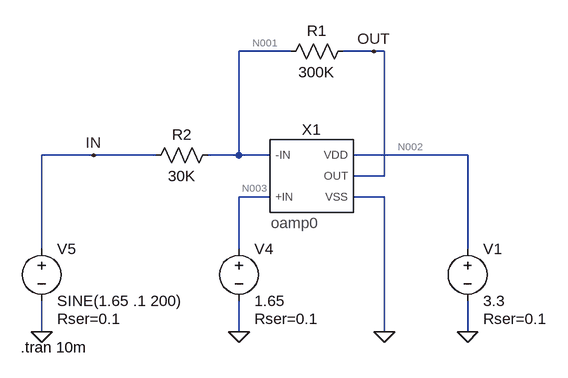
[diagram p0: schematic oamp0_test.asc]
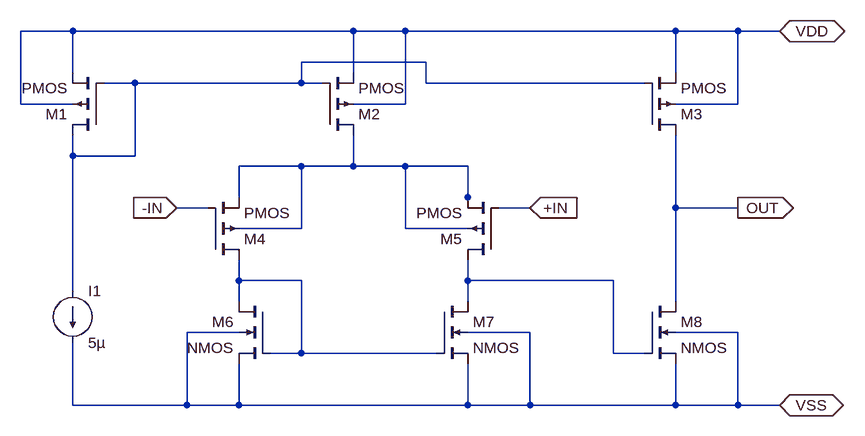
[diagram p1: sub-circuit oamp0.asc]
oamp0_test.asc, the LTspice schematic file:
Version 4
SHEET 1 1004 680
WIRE -160 -96 -240 -96
WIRE -32 -96 -80 -96
WIRE -16 -96 -32 -96
WIRE -464 64 -544 64
WIRE -368 64 -464 64
WIRE -240 64 -240 -96
WIRE -240 64 -288 64
WIRE -192 64 -240 64
WIRE 112 64 -64 64
WIRE -16 96 -16 -96
WIRE -16 96 -64 96
WIRE -192 128 -240 128
WIRE -16 128 -64 128
WIRE -544 208 -544 64
WIRE -240 208 -240 128
WIRE 112 208 112 64
WIRE -544 336 -544 288
WIRE -240 336 -240 288
WIRE -16 336 -16 128
WIRE 112 336 112 288
FLAG 112 336 0
FLAG -16 336 0
FLAG -240 336 0
FLAG -544 336 0
FLAG -464 64 IN
FLAG -32 -96 OUT
SYMBOL res -64 -112 R90
WINDOW 0 0 56 VBottom 2
WINDOW 3 32 56 VTop 2
SYMATTR InstName R1
SYMATTR Value 300K
SYMBOL res -272 48 R90
WINDOW 0 0 56 VBottom 2
WINDOW 3 32 56 VTop 2
SYMATTR InstName R2
SYMATTR Value 30K
SYMBOL oamp0 -128 96 R0
SYMATTR InstName X1
SYMBOL voltage 112 192 R0
WINDOW 123 0 0 Left 2
WINDOW 39 24 124 Left 2
SYMATTR SpiceLine Rser=0.1
SYMATTR InstName V1
SYMATTR Value 3.3
SYMBOL voltage -240 192 R0
WINDOW 123 0 0 Left 2
WINDOW 39 24 124 Left 2
SYMATTR SpiceLine Rser=0.1
SYMATTR InstName V4
SYMATTR Value 1.65
SYMBOL voltage -544 192 R0
WINDOW 123 0 0 Left 2
WINDOW 39 24 124 Left 2
SYMATTR SpiceLine Rser=0.1
SYMATTR InstName V5
SYMATTR Value SINE(1.65 .1 200)
TEXT -576 360 Left 2 !.tran 10m

oamp0.asc, the sub-circuit schematic file:
Version 4
SHEET 1 1132 680
WIRE -64 -16 -144 -16
WIRE 368 -16 -64 -16
WIRE 448 -16 368 -16
WIRE 864 -16 448 -16
WIRE 960 -16 864 -16
WIRE 1024 -16 960 -16
WIRE 480 32 288 32
WIRE -64 48 -64 -16
WIRE 368 48 368 -16
WIRE 864 48 864 -16
WIRE 32 64 -16 64
WIRE 288 64 288 32
WIRE 288 64 32 64
WIRE 320 64 288 64
WIRE 480 64 480 32
WIRE 816 64 480 64
WIRE -144 96 -144 -16
WIRE -64 96 -144 96
WIRE 448 96 448 -16
WIRE 448 96 368 96
WIRE 960 96 960 -16
WIRE 960 96 864 96
WIRE -64 176 -64 144
WIRE 32 176 32 64
WIRE 32 176 -64 176
WIRE 288 192 192 192
WIRE 368 192 368 144
WIRE 368 192 288 192
WIRE 448 192 368 192
WIRE 544 192 448 192
WIRE 192 240 192 192
WIRE 544 240 544 192
WIRE 144 256 96 256
WIRE 544 256 544 240
WIRE 640 256 592 256
WIRE 864 256 864 144
WIRE 960 256 864 256
WIRE 288 288 288 192
WIRE 288 288 192 288
WIRE 448 288 448 192
WIRE 544 288 448 288
WIRE 192 368 192 336
WIRE 288 368 192 368
WIRE 544 368 544 336
WIRE 768 368 544 368
WIRE -64 384 -64 176
WIRE 192 400 192 368
WIRE 544 400 544 368
WIRE 864 400 864 256
WIRE 192 448 112 448
WIRE 640 448 544 448
WIRE 960 448 864 448
WIRE 288 480 288 368
WIRE 288 480 240 480
WIRE 496 480 288 480
WIRE 768 480 768 368
WIRE 816 480 768 480
WIRE -64 560 -64 464
WIRE 112 560 112 448
WIRE 112 560 -64 560
WIRE 192 560 192 496
WIRE 192 560 112 560
WIRE 544 560 544 496
WIRE 544 560 192 560
WIRE 640 560 640 448
WIRE 640 560 544 560
WIRE 864 560 864 496
WIRE 864 560 640 560
WIRE 960 560 960 448
WIRE 960 560 864 560
WIRE 1024 560 960 560
FLAG 96 256 -IN
IOPIN 96 256 In
FLAG 640 256 +IN
IOPIN 640 256 In
FLAG 960 256 OUT
IOPIN 960 256 Out
FLAG 1024 -16 VDD
IOPIN 1024 -16 BiDir
FLAG 1024 560 VSS
IOPIN 1024 560 BiDir
SYMBOL pmos4 -16 144 R180
SYMATTR InstName M1
SYMATTR Value2 l=8u w=1u
SYMBOL pmos4 320 144 M180
SYMATTR InstName M2
SYMATTR Value2 l=8u w=6u
SYMBOL pmos4 816 144 M180
SYMATTR InstName M3
SYMATTR Value2 l=10u w=32u
SYMBOL pmos4 144 336 M180
SYMATTR InstName M4
SYMATTR Value2 l=1u w=8u
SYMBOL pmos4 592 336 R180
SYMATTR InstName M5
SYMATTR Value2 l=1u w=8u
SYMBOL nmos4 240 400 M0
SYMATTR InstName M6
SYMATTR Value2 l=10u w=8u
SYMBOL nmos4 496 400 R0
SYMATTR InstName M7
SYMATTR Value2 l=10u w=8u
SYMBOL nmos4 816 400 R0
SYMATTR InstName M8
SYMATTR Value2 l=8u w=12u
SYMBOL current -64 384 R0
WINDOW 123 0 0 Left 2
WINDOW 39 0 0 Left 2
SYMATTR InstName I1
SYMATTR Value 5µ

The netlist it stands for:
* oamp0_test.asc
R1 OUT N001 300K
R2 N001 IN 30K
XX1 N003 N001 OUT N002 0 oamp0
V1 N002 0 3.3 Rser=0.1
V4 N003 0 1.65 Rser=0.1
V5 IN 0 SINE(1.65 .1 200) Rser=0.1

* block symbol definitions
.subckt oamp0 +IN -IN OUT VDD VSS
M1 N001 N001 VDD VDD PMOS l=8u w=1u
M2 N002 N001 VDD VDD PMOS l=8u w=6u
M3 OUT N001 VDD VDD PMOS l=10u w=32u
M4 N003 -IN N002 N002 PMOS l=1u w=8u
M5 N004 +IN N002 N002 PMOS l=1u w=8u
M6 N003 N003 VSS VSS NMOS l=10u w=8u
M7 N004 N003 VSS VSS NMOS l=10u w=8u
M8 OUT N004 VSS VSS NMOS l=8u w=12u
I1 N001 VSS 5µ
.ends oamp0

.model NMOS NMOS
.model PMOS PMOS
.lib standard.mos
.tran 10m
.backanno
.end

* Results of the author's LTspice run, read from the files saved beside the schematic
* Operating Point, zero values left out:
*   V(out) = 2.755 V
*   V(n001) = 1.75 V
*   V(in) = 1.65 V
*   V(n002) = 3.3 V
*   V(n003) = 1.65 V
*   I(R2) = 3.348 µA
*   I(R1) = 3.348 µA
*   I(V5) = 3.348 µA
*   I(V1) = -89.95 µA
*   Ix(x1:OUT) = -3.348 µA
*   Ix(x1:VDD) = 89.95 µA
*   Ix(x1:VSS) = -86.6 µA
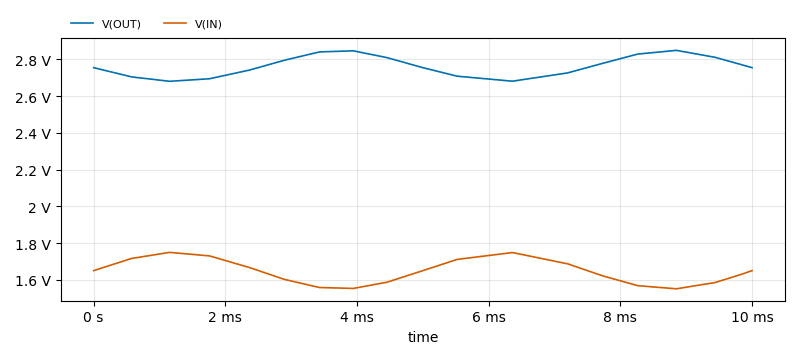
[diagram p2: Transient Analysis of oamp0_test.asc, plotted from the saved traces]
* Transient Analysis, 1 run:
*   V(OUT): min 2.68 V, max 2.849 V, average 2.76 V, rms 2.761 V, last 2.755 V
*   V(IN): min 1.551 V, max 1.749 V, average 1.649 V, rms 1.651 V, last 1.65 V